# Altium schematic sheet NutX_Keyboard_PCB_ANSI104.SchDoc
size A0
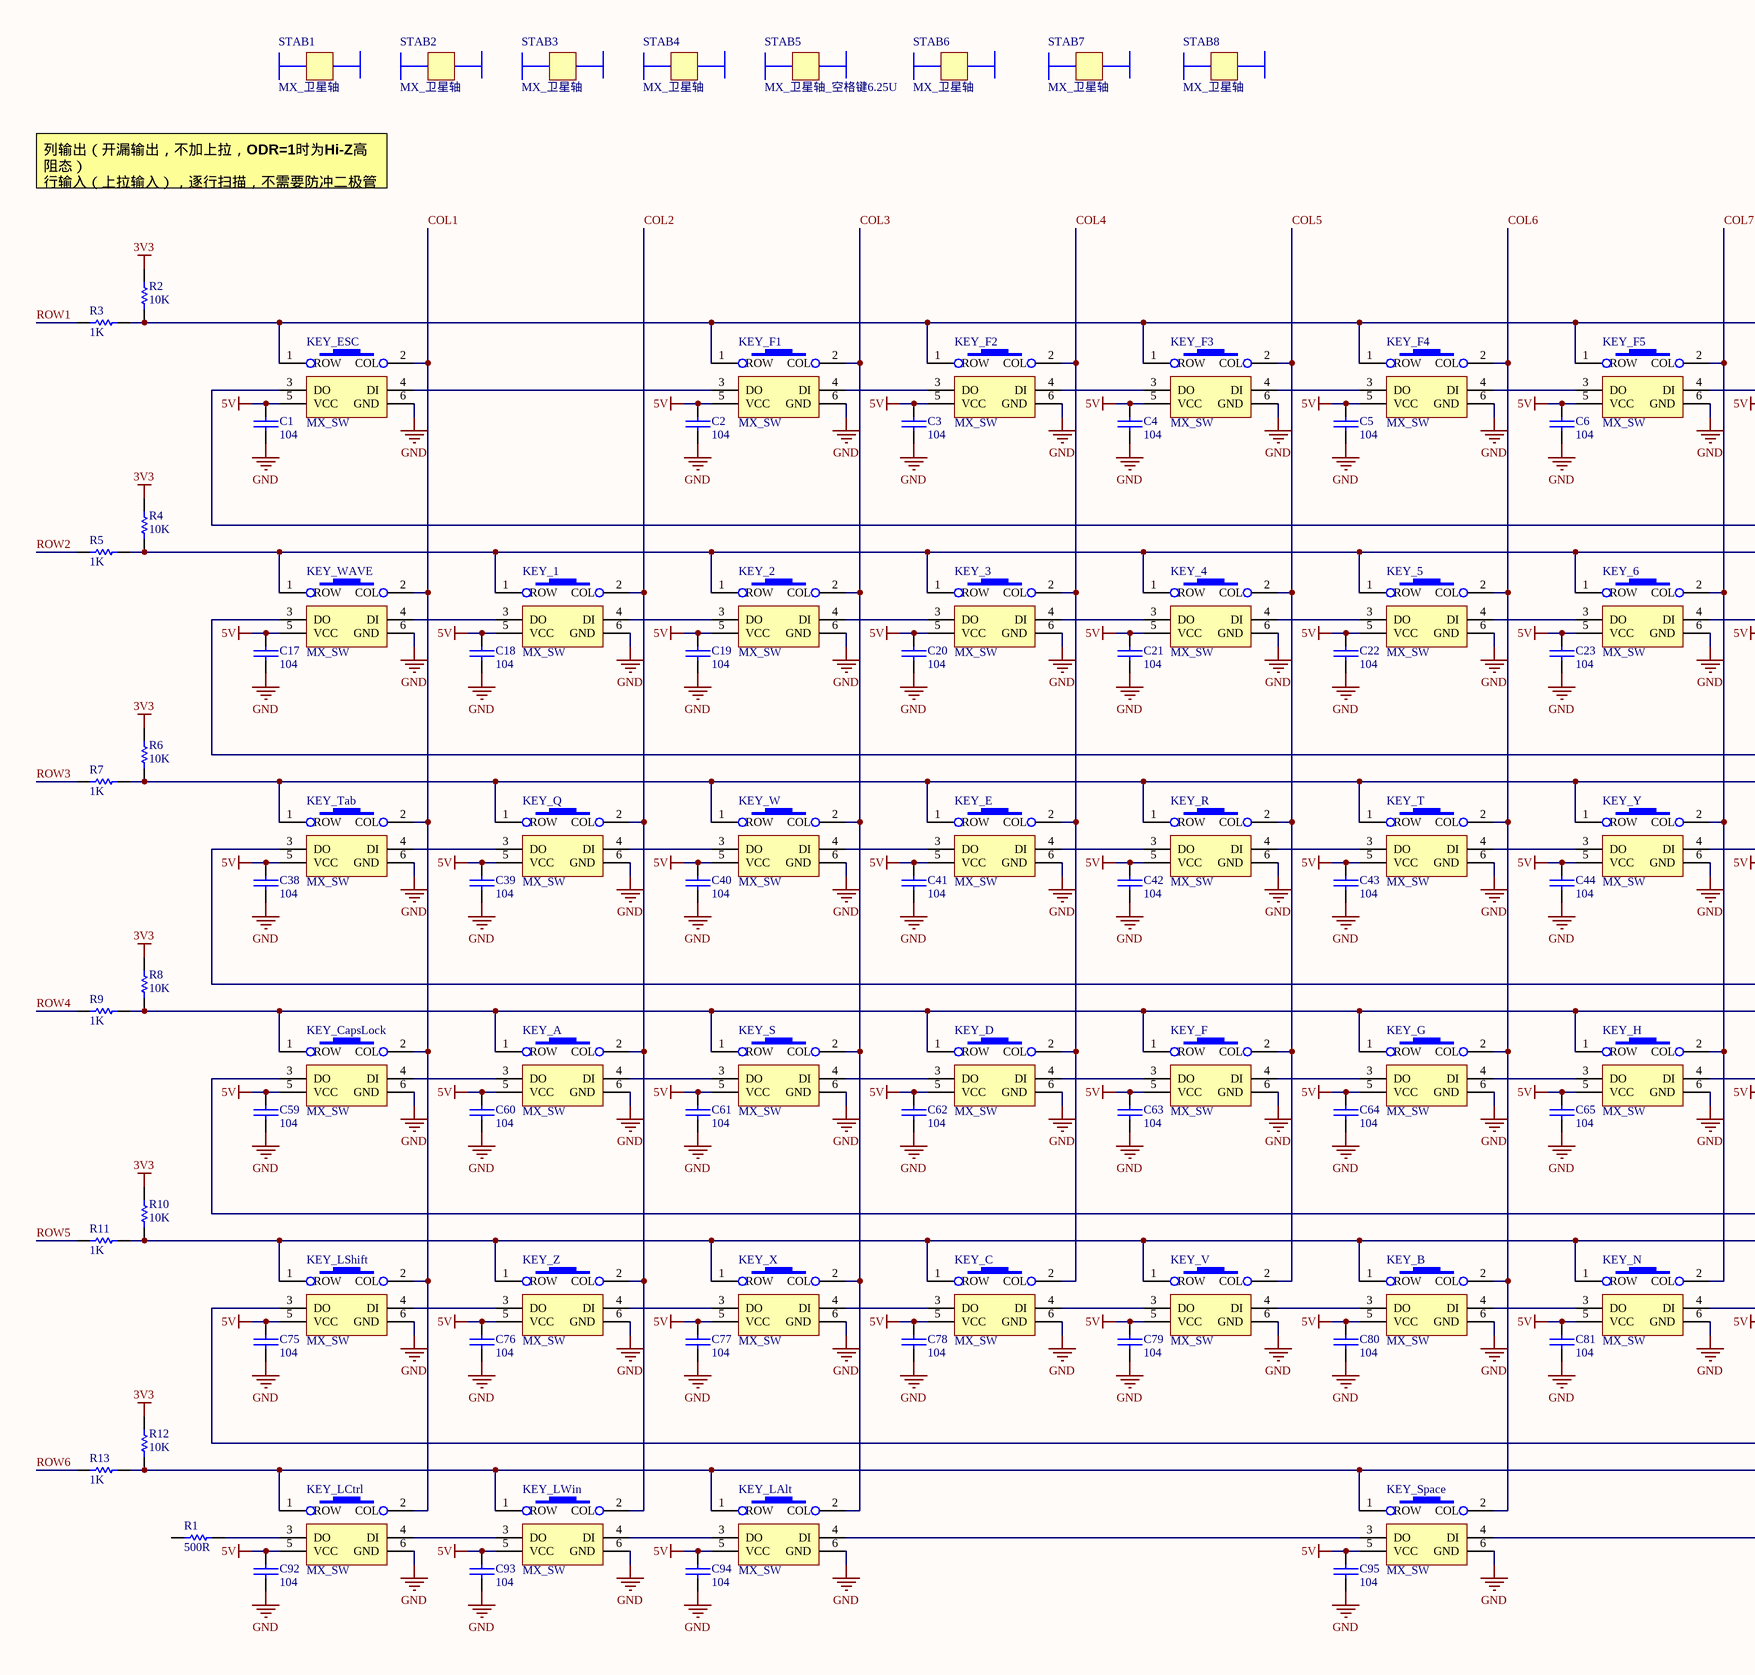
[diagram p0: NutX_Keyboard_PCB_ANSI104.SchDoc, left]
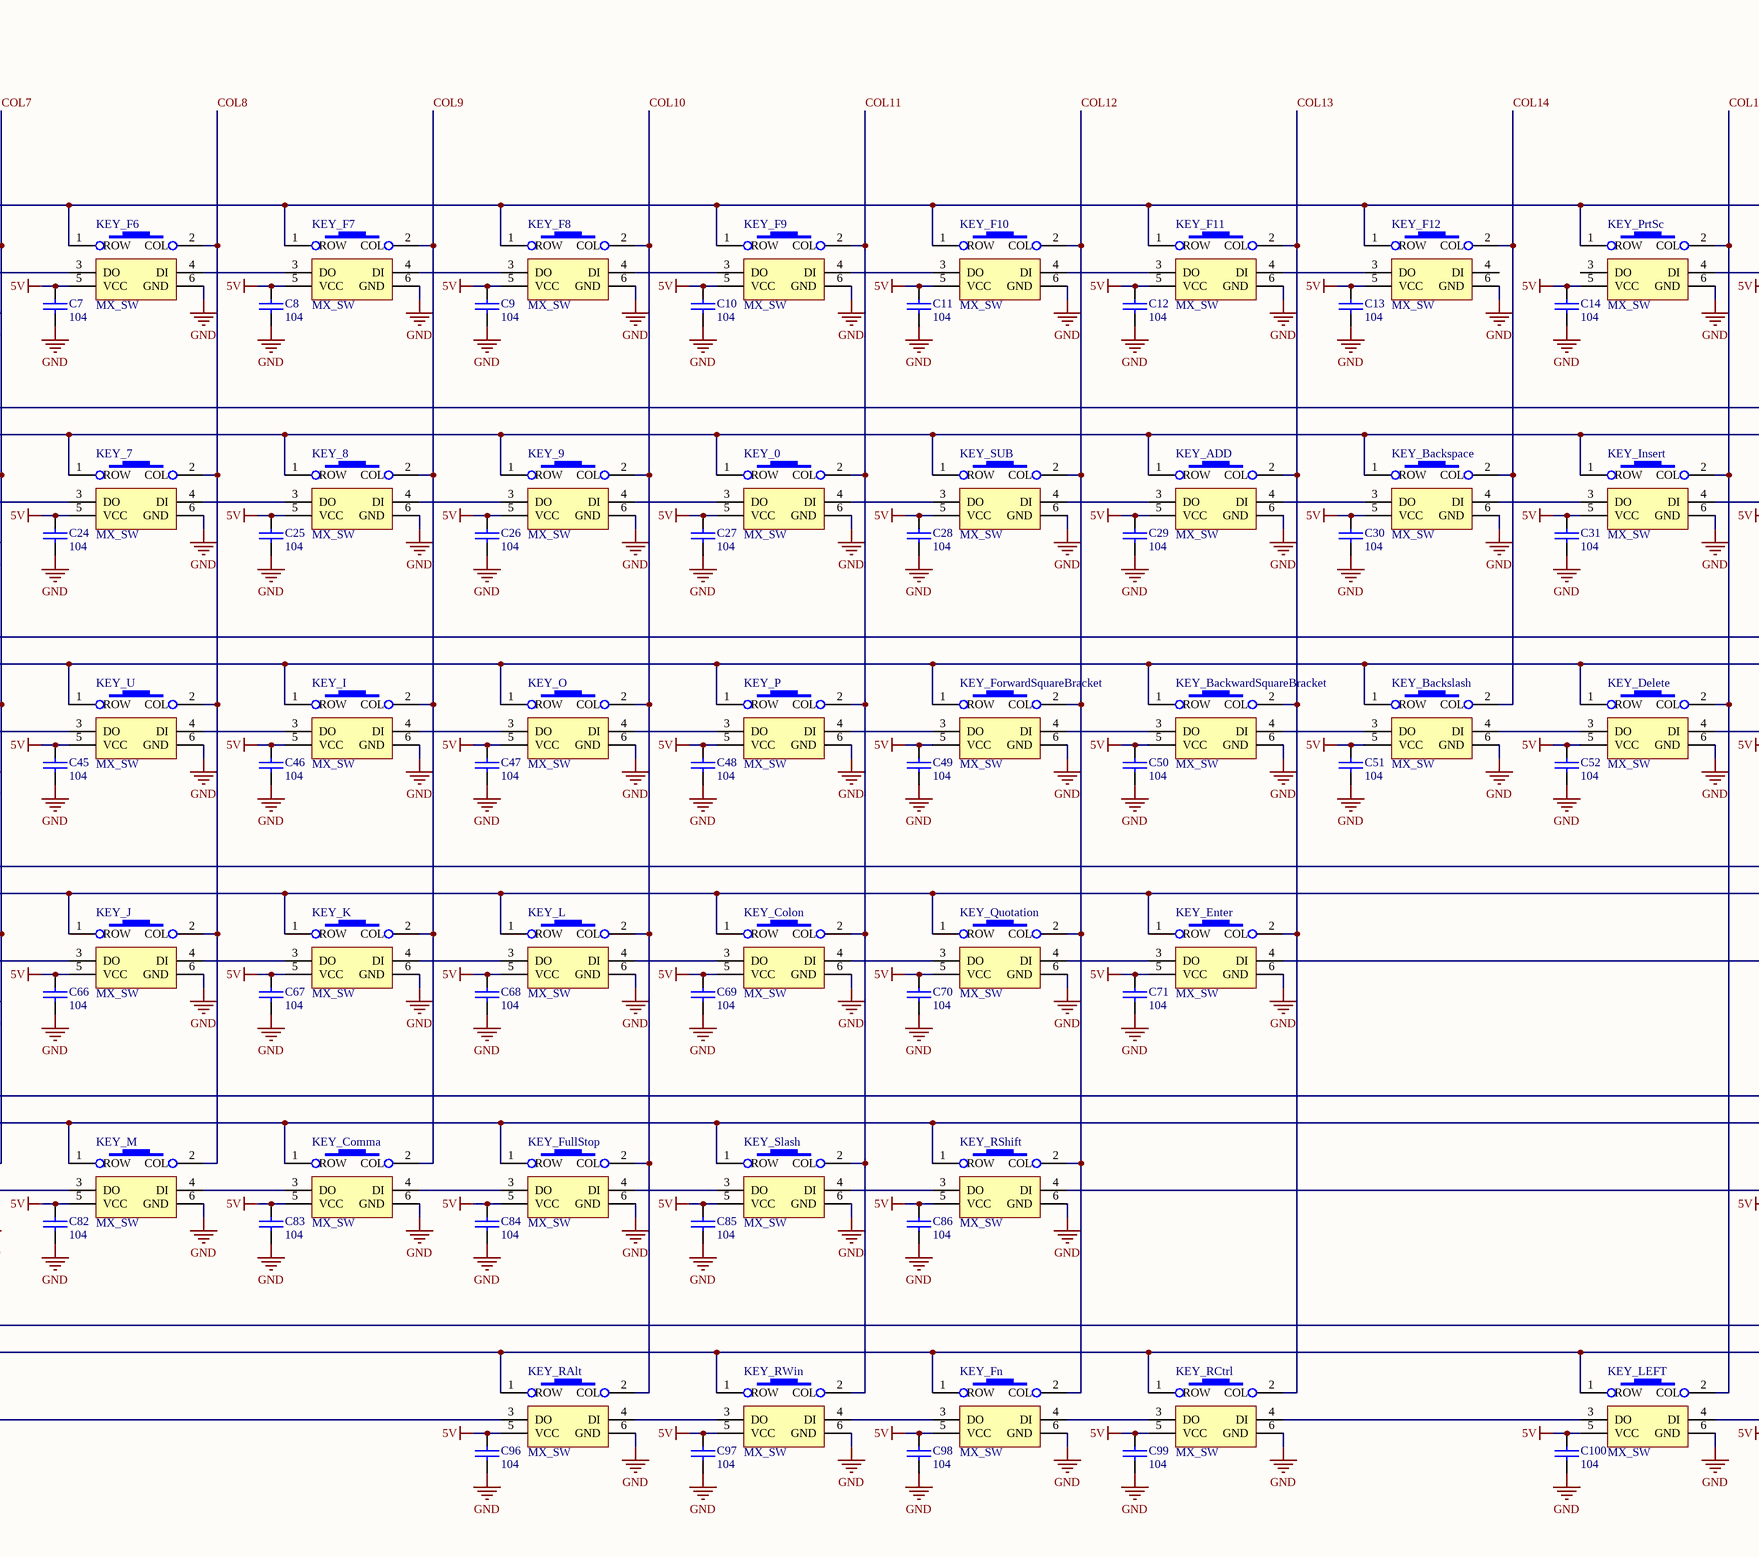
[diagram p1: NutX_Keyboard_PCB_ANSI104.SchDoc, middle]
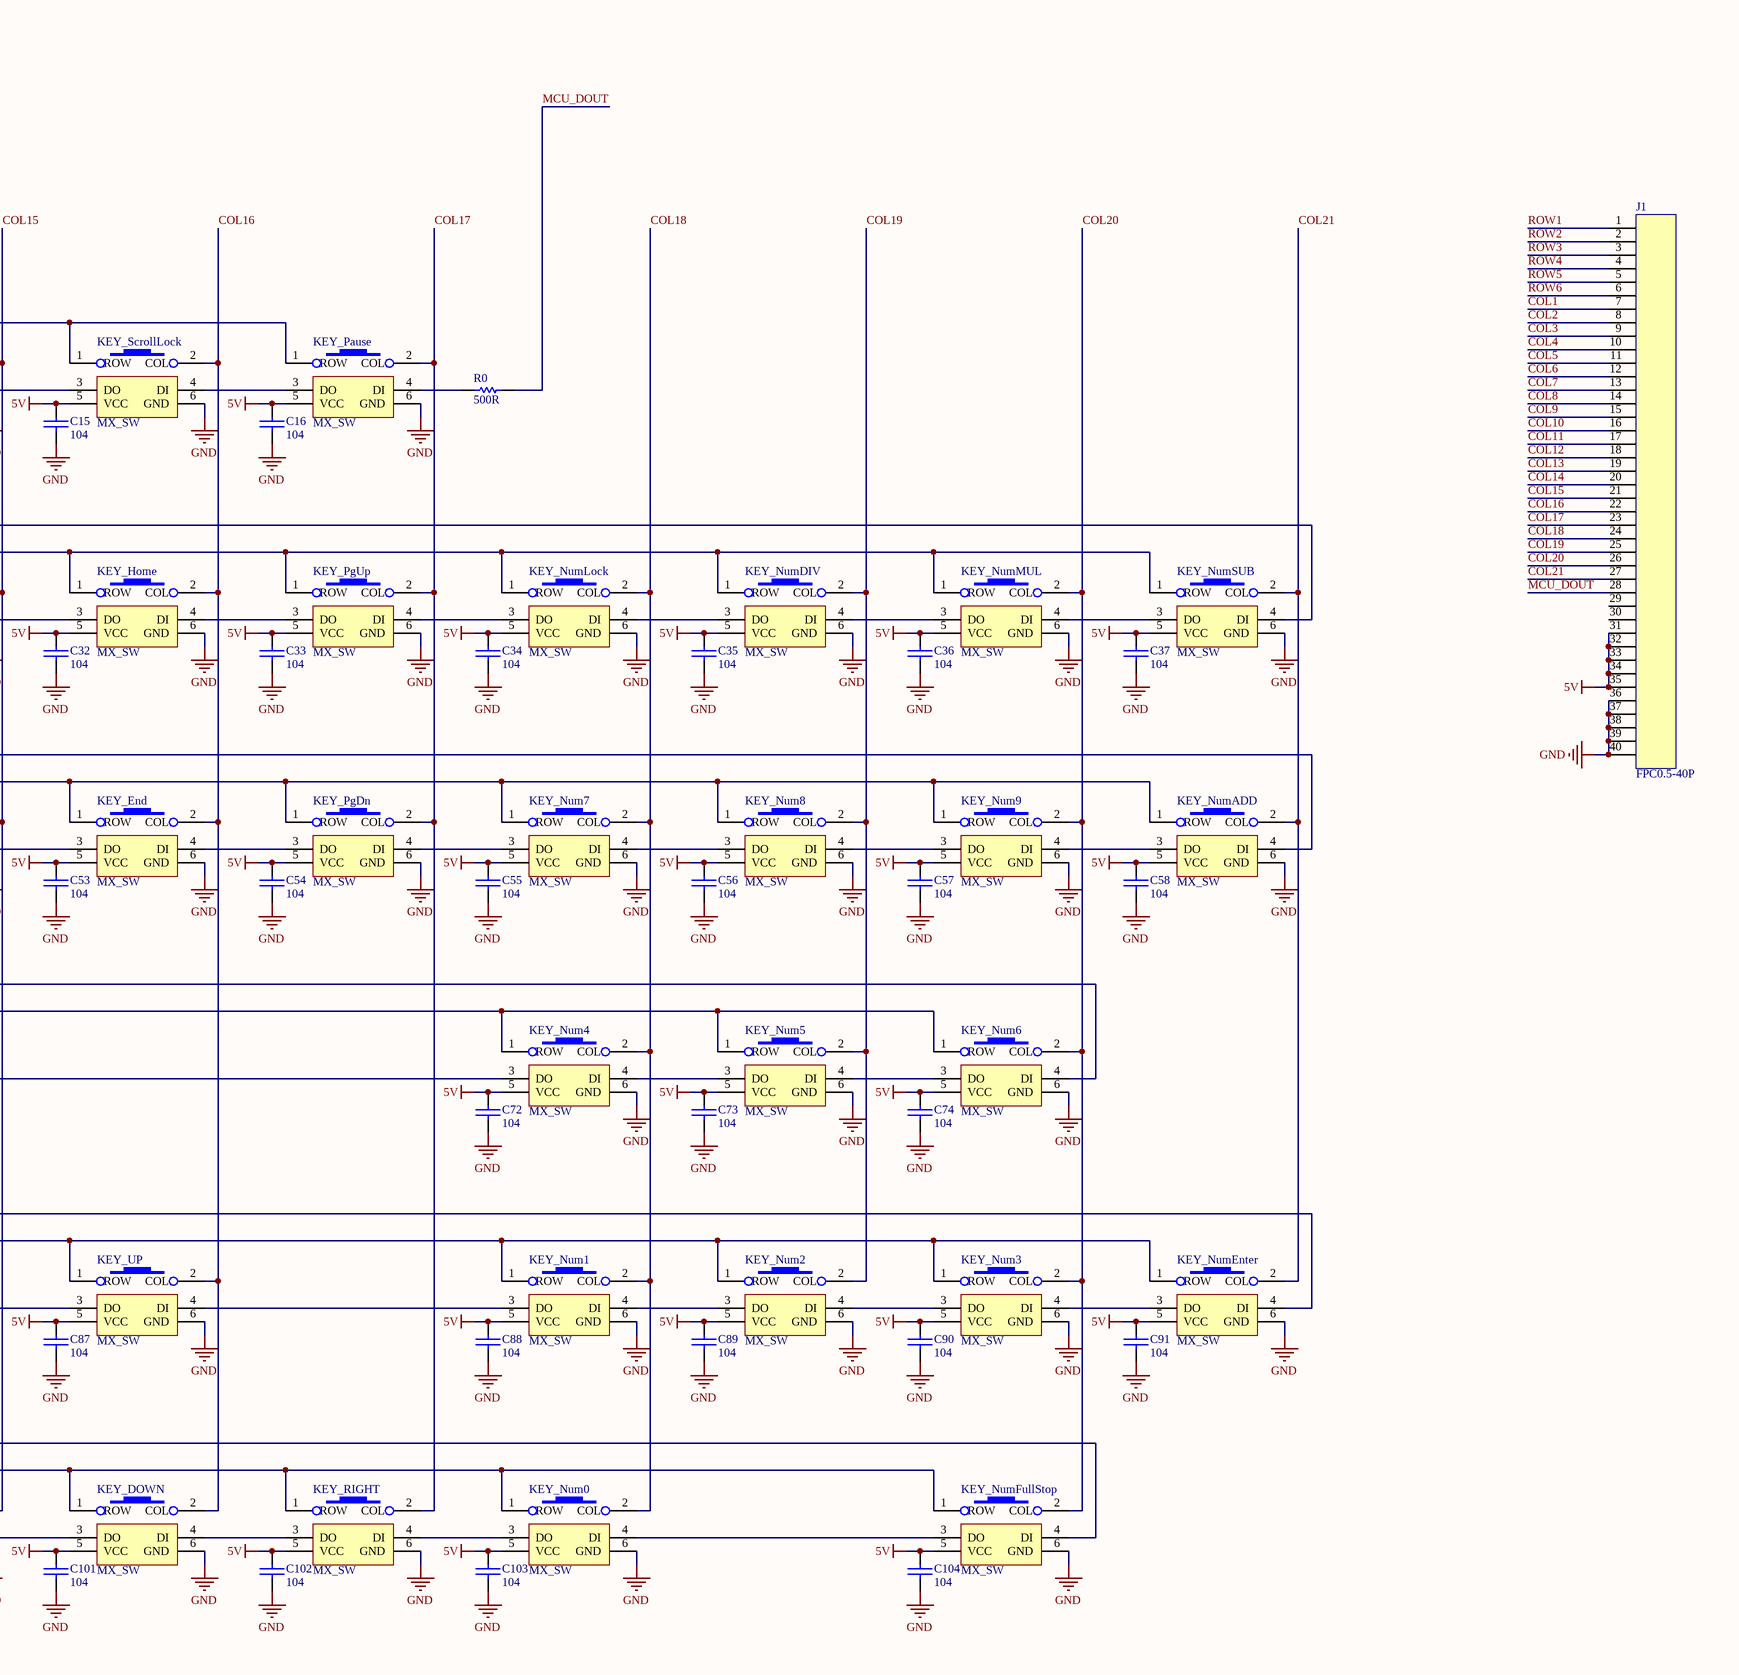
[diagram p2: NutX_Keyboard_PCB_ANSI104.SchDoc, right]

## Parts
C1  104  [0603C]
C2  104  [0603C]
C3  104  [0603C]
C4  104  [0603C]
C5  104  [0603C]
C6  104  [0603C]
C7  104  [0603C]
C8  104  [0603C]
C9  104  [0603C]
C10  104  [0603C]
C11  104  [0603C]
C12  104  [0603C]
C13  104  [0603C]
C14  104  [0603C]
C15  104  [0603C]
C16  104  [0603C]
C17  104  [0603C]
C18  104  [0603C]
C19  104  [0603C]
C20  104  [0603C]
C21  104  [0603C]
C22  104  [0603C]
C23  104  [0603C]
C24  104  [0603C]
C25  104  [0603C]
C26  104  [0603C]
C27  104  [0603C]
C28  104  [0603C]
C29  104  [0603C]
C30  104  [0603C]
C31  104  [0603C]
C32  104  [0603C]
C33  104  [0603C]
C34  104  [0603C]
C35  104  [0603C]
C36  104  [0603C]
C37  104  [0603C]
C38  104  [0603C]
C39  104  [0603C]
C40  104  [0603C]
C41  104  [0603C]
C42  104  [0603C]
C43  104  [0603C]
C44  104  [0603C]
C45  104  [0603C]
C46  104  [0603C]
C47  104  [0603C]
C48  104  [0603C]
C49  104  [0603C]
C50  104  [0603C]
C51  104  [0603C]
C52  104  [0603C]
C53  104  [0603C]
C54  104  [0603C]
C55  104  [0603C]
C56  104  [0603C]
C57  104  [0603C]
C58  104  [0603C]
C59  104  [0603C]
C60  104  [0603C]
C61  104  [0603C]
C62  104  [0603C]
C63  104  [0603C]
C64  104  [0603C]
C65  104  [0603C]
C66  104  [0603C]
C67  104  [0603C]
C68  104  [0603C]
C69  104  [0603C]
C70  104  [0603C]
C71  104  [0603C]
C72  104  [0603C]
C73  104  [0603C]
C74  104  [0603C]
C75  104  [0603C]
C76  104  [0603C]
C77  104  [0603C]
C78  104  [0603C]
C79  104  [0603C]
C80  104  [0603C]
C81  104  [0603C]
C82  104  [0603C]
C83  104  [0603C]
C84  104  [0603C]
C85  104  [0603C]
C86  104  [0603C]
C87  104  [0603C]
C88  104  [0603C]
C89  104  [0603C]
C90  104  [0603C]
C91  104  [0603C]
C92  104  [0603C]
C93  104  [0603C]
C94  104  [0603C]
C95  104  [0603C]
C96  104  [0603C]
C97  104  [0603C]
C98  104  [0603C]
C99  104  [0603C]
C100  104  [0603C]
C101  104  [0603C]
C102  104  [0603C]
C103  104  [0603C]
C104  104  [0603C]
J1  FPC0.5-40P  [FPC0.5-40P]
KEY_0  MX_SW  [MX_Normal_1U]
KEY_1  MX_SW  [MX_Normal_1U]
KEY_2  MX_SW  [MX_Normal_1U]
KEY_3  MX_SW  [MX_Normal_1U]
KEY_4  MX_SW  [MX_Normal_1U]
KEY_5  MX_SW  [MX_Normal_1U]
KEY_6  MX_SW  [MX_Normal_1U]
KEY_7  MX_SW  [MX_Normal_1U]
KEY_8  MX_SW  [MX_Normal_1U]
KEY_9  MX_SW  [MX_Normal_1U]
KEY_A  MX_SW  [MX_Normal_1U]
KEY_ADD  MX_SW  [MX_Normal_1U]
KEY_B  MX_SW  [MX_Normal_1U]
KEY_Backslash  MX_SW  [MX_Tab_1.5U]
KEY_Backspace  MX_SW  [MX_Backspace_2U]
KEY_BackwardSquareBracket  MX_SW  [MX_Normal_1U]
KEY_C  MX_SW  [MX_Normal_1U]
KEY_CapsLock  MX_SW  [MX_CapsLock_1.75U]
KEY_Colon  MX_SW  [MX_Normal_1U]
KEY_Comma  MX_SW  [MX_Normal_1U]
KEY_D  MX_SW  [MX_Normal_1U]
KEY_Delete  MX_SW  [MX_Normal_1U]
KEY_DOWN  MX_SW  [MX_Normal_1U]
KEY_E  MX_SW  [MX_Normal_1U]
KEY_End  MX_SW  [MX_Normal_1U]
KEY_Enter  MX_SW  [MX_LeftShift_Enter_2.25U]
KEY_ESC  MX_SW  [MX_Normal_1U]
KEY_F  MX_SW  [MX_Normal_1U]
KEY_F1  MX_SW  [MX_Normal_1U]
KEY_F2  MX_SW  [MX_Normal_1U]
KEY_F3  MX_SW  [MX_Normal_1U]
KEY_F4  MX_SW  [MX_Normal_1U]
KEY_F5  MX_SW  [MX_Normal_1U]
KEY_F6  MX_SW  [MX_Normal_1U]
KEY_F7  MX_SW  [MX_Normal_1U]
KEY_F8  MX_SW  [MX_Normal_1U]
KEY_F9  MX_SW  [MX_Normal_1U]
KEY_F10  MX_SW  [MX_Normal_1U]
KEY_F11  MX_SW  [MX_Normal_1U]
KEY_F12  MX_SW  [MX_Normal_1U]
KEY_Fn  MX_SW  [MX_Ctrl_Win_Alt_1.25U]
KEY_ForwardSquareBracket  MX_SW  [MX_Normal_1U]
KEY_FullStop  MX_SW  [MX_Normal_1U]
KEY_G  MX_SW  [MX_Normal_1U]
KEY_H  MX_SW  [MX_Normal_1U]
KEY_Home  MX_SW  [MX_Normal_1U]
KEY_I  MX_SW  [MX_Normal_1U]
KEY_Insert  MX_SW  [MX_Normal_1U]
KEY_J  MX_SW  [MX_Normal_1U]
KEY_K  MX_SW  [MX_Normal_1U]
KEY_L  MX_SW  [MX_Normal_1U]
KEY_LAlt  MX_SW  [MX_Ctrl_Win_Alt_1.25U]
KEY_LCtrl  MX_SW  [MX_Ctrl_Win_Alt_1.25U]
KEY_LEFT  MX_SW  [MX_Normal_1U]
KEY_LShift  MX_SW  [MX_LeftShift_Enter_2.25U]
KEY_LWin  MX_SW  [MX_Ctrl_Win_Alt_1.25U]
KEY_M  MX_SW  [MX_Normal_1U]
KEY_N  MX_SW  [MX_Normal_1U]
KEY_Num0  MX_SW  [MX_Backspace_2U]
KEY_Num1  MX_SW  [MX_Normal_1U]
KEY_Num2  MX_SW  [MX_Normal_1U]
KEY_Num3  MX_SW  [MX_Normal_1U]
KEY_Num4  MX_SW  [MX_Normal_1U]
KEY_Num5  MX_SW  [MX_Normal_1U]
KEY_Num6  MX_SW  [MX_Normal_1U]
KEY_Num7  MX_SW  [MX_Normal_1U]
KEY_Num8  MX_SW  [MX_Normal_1U]
KEY_Num9  MX_SW  [MX_Normal_1U]
KEY_NumADD  MX_SW  [MX_Backspace_2U]
KEY_NumDIV  MX_SW  [MX_Normal_1U]
KEY_NumEnter  MX_SW  [MX_Backspace_2U]
KEY_NumFullStop  MX_SW  [MX_Normal_1U]
KEY_NumLock  MX_SW  [MX_Normal_1U]
KEY_NumMUL  MX_SW  [MX_Normal_1U]
KEY_NumSUB  MX_SW  [MX_Normal_1U]
KEY_O  MX_SW  [MX_Normal_1U]
KEY_P  MX_SW  [MX_Normal_1U]
KEY_Pause  MX_SW  [MX_Normal_1U]
KEY_PgDn  MX_SW  [MX_Normal_1U]
KEY_PgUp  MX_SW  [MX_Normal_1U]
KEY_PrtSc  MX_SW  [MX_Normal_1U]
KEY_Q  MX_SW  [MX_Normal_1U]
KEY_Quotation  MX_SW  [MX_Normal_1U]
KEY_R  MX_SW  [MX_Normal_1U]
KEY_RAlt  MX_SW  [MX_Ctrl_Win_Alt_1.25U]
KEY_RCtrl  MX_SW  [MX_Ctrl_Win_Alt_1.25U]
KEY_RIGHT  MX_SW  [MX_Normal_1U]
KEY_RShift  MX_SW  [MX_RightShift_2.75U]
KEY_RWin  MX_SW  [MX_Ctrl_Win_Alt_1.25U]
KEY_S  MX_SW  [MX_Normal_1U]
KEY_ScrollLock  MX_SW  [MX_Normal_1U]
KEY_Slash  MX_SW  [MX_Normal_1U]
KEY_Space  MX_SW  [MX_Space_6.25U]
KEY_SUB  MX_SW  [MX_Normal_1U]
KEY_T  MX_SW  [MX_Normal_1U]
KEY_Tab  MX_SW  [MX_Tab_1.5U]
KEY_U  MX_SW  [MX_Normal_1U]
KEY_UP  MX_SW  [MX_Normal_1U]
KEY_V  MX_SW  [MX_Normal_1U]
KEY_W  MX_SW  [MX_Normal_1U]
KEY_WAVE  MX_SW  [MX_Normal_1U]
KEY_X  MX_SW  [MX_Normal_1U]
KEY_Y  MX_SW  [MX_Normal_1U]
KEY_Z  MX_SW  [MX_Normal_1U]
R0  500R  [0603R]
R1  500R  [0603R]
R2  10K  [0603R]
R3  1K  [0603R]
R4  10K  [0603R]
R5  1K  [0603R]
R6  10K  [0603R]
R7  1K  [0603R]
R8  10K  [0603R]
R9  1K  [0603R]
R10  10K  [0603R]
R11  1K  [0603R]
R12  10K  [0603R]
R13  1K  [0603R]
STAB1  MX_卫星轴  [1X2]
STAB2  MX_卫星轴  [1X2]
STAB3  MX_卫星轴  [1X2]
STAB4  MX_卫星轴  [1X2]
STAB5  MX_卫星轴_空格键6.25U  [1x6.25]
STAB6  MX_卫星轴  [1X2]
STAB7  MX_卫星轴  [1X2]
STAB8  MX_卫星轴  [1X2]

## Nets
3V3: R2.2 R4.2 R6.2 R8.2 R10.2 R12.2
5V: C1.2 C2.2 C3.2 C4.2 C5.2 C6.2 C7.2 C8.2 C9.2 C10.2 C11.2 C12.2 C13.2 C14.2 C15.2 C16.2 C17.2 C18.2 C19.2 C20.2 C21.2 C22.2 C23.2 C24.2 C25.2 C26.2 C27.2 C28.2 C29.2 C30.2 C31.2 C32.2 C33.2 C34.2 C35.2 C36.2 C37.2 C38.2 C39.2 C40.2 C41.2 C42.2 C43.2 C44.2 C45.2 C46.2 C47.2 C48.2 C49.2 C50.2 C51.2 C52.2 C53.2 C54.2 C55.2 C56.2 C57.2 C58.2 C59.2 C60.2 C61.2 C62.2 C63.2 C64.2 C65.2 C66.2 C67.2 C68.2 C69.2 C70.2 C71.2 C72.2 C73.2 C74.2 C75.2 C76.2 C77.2 C78.2 C79.2 C80.2 C81.2 C82.2 C83.2 C84.2 C85.2 C86.2 C87.2 C88.2 C89.2 C90.2 C91.2 C92.2 C93.2 C94.2 C95.2 C96.2 C97.2 C98.2 C99.2 C100.2 C101.2 C102.2 C103.2 C104.2 J1.31 J1.32 J1.33 J1.34 J1.35 KEY_0.5(VCC) KEY_1.5(VCC) KEY_2.5(VCC) KEY_3.5(VCC) KEY_4.5(VCC) KEY_5.5(VCC) KEY_6.5(VCC) KEY_7.5(VCC) KEY_8.5(VCC) KEY_9.5(VCC) KEY_A.5(VCC) KEY_ADD.5(VCC) KEY_B.5(VCC) KEY_Backslash.5(VCC) KEY_Backspace.5(VCC) KEY_BackwardSquareBracket.5(VCC) KEY_C.5(VCC) KEY_CapsLock.5(VCC) KEY_Colon.5(VCC) KEY_Comma.5(VCC) KEY_D.5(VCC) KEY_Delete.5(VCC) KEY_DOWN.5(VCC) KEY_E.5(VCC) KEY_End.5(VCC) KEY_Enter.5(VCC) KEY_ESC.5(VCC) KEY_F.5(VCC) KEY_F1.5(VCC) KEY_F2.5(VCC) KEY_F3.5(VCC) KEY_F4.5(VCC) KEY_F5.5(VCC) KEY_F6.5(VCC) KEY_F7.5(VCC) KEY_F8.5(VCC) KEY_F9.5(VCC) KEY_F10.5(VCC) KEY_F11.5(VCC) KEY_F12.5(VCC) KEY_Fn.5(VCC) KEY_ForwardSquareBracket.5(VCC) KEY_FullStop.5(VCC) KEY_G.5(VCC) KEY_H.5(VCC) KEY_Home.5(VCC) KEY_I.5(VCC) KEY_Insert.5(VCC) KEY_J.5(VCC) KEY_K.5(VCC) KEY_L.5(VCC) KEY_LAlt.5(VCC) KEY_LCtrl.5(VCC) KEY_LEFT.5(VCC) KEY_LShift.5(VCC) KEY_LWin.5(VCC) KEY_M.5(VCC) KEY_N.5(VCC) KEY_Num0.5(VCC) KEY_Num1.5(VCC) KEY_Num2.5(VCC) KEY_Num3.5(VCC) KEY_Num4.5(VCC) KEY_Num5.5(VCC) KEY_Num6.5(VCC) KEY_Num7.5(VCC) KEY_Num8.5(VCC) KEY_Num9.5(VCC) KEY_NumADD.5(VCC) KEY_NumDIV.5(VCC) KEY_NumEnter.5(VCC) KEY_NumFullStop.5(VCC) KEY_NumLock.5(VCC) KEY_NumMUL.5(VCC) KEY_NumSUB.5(VCC) KEY_O.5(VCC) KEY_P.5(VCC) KEY_Pause.5(VCC) KEY_PgDn.5(VCC) KEY_PgUp.5(VCC) KEY_PrtSc.5(VCC) KEY_Q.5(VCC) KEY_Quotation.5(VCC) KEY_R.5(VCC) KEY_RAlt.5(VCC) KEY_RCtrl.5(VCC) KEY_RIGHT.5(VCC) KEY_RShift.5(VCC) KEY_RWin.5(VCC) KEY_S.5(VCC) KEY_ScrollLock.5(VCC) KEY_Slash.5(VCC) KEY_Space.5(VCC) KEY_SUB.5(VCC) KEY_T.5(VCC) KEY_Tab.5(VCC) KEY_U.5(VCC) KEY_UP.5(VCC) KEY_V.5(VCC) KEY_W.5(VCC) KEY_WAVE.5(VCC) KEY_X.5(VCC) KEY_Y.5(VCC) KEY_Z.5(VCC)
GND: C1.1 C2.1 C3.1 C4.1 C5.1 C6.1 C7.1 C8.1 C9.1 C10.1 C11.1 C12.1 C13.1 C14.1 C15.1 C16.1 C17.1 C18.1 C19.1 C20.1 C21.1 C22.1 C23.1 C24.1 C25.1 C26.1 C27.1 C28.1 C29.1 C30.1 C31.1 C32.1 C33.1 C34.1 C35.1 C36.1 C37.1 C38.1 C39.1 C40.1 C41.1 C42.1 C43.1 C44.1 C45.1 C46.1 C47.1 C48.1 C49.1 C50.1 C51.1 C52.1 C53.1 C54.1 C55.1 C56.1 C57.1 C58.1 C59.1 C60.1 C61.1 C62.1 C63.1 C64.1 C65.1 C66.1 C67.1 C68.1 C69.1 C70.1 C71.1 C72.1 C73.1 C74.1 C75.1 C76.1 C77.1 C78.1 C79.1 C80.1 C81.1 C82.1 C83.1 C84.1 C85.1 C86.1 C87.1 C88.1 C89.1 C90.1 C91.1 C92.1 C93.1 C94.1 C95.1 C96.1 C97.1 C98.1 C99.1 C100.1 C101.1 C102.1 C103.1 C104.1 J1.36 J1.37 J1.38 J1.39 J1.40 KEY_0.6(GND) KEY_1.6(GND) KEY_2.6(GND) KEY_3.6(GND) KEY_4.6(GND) KEY_5.6(GND) KEY_6.6(GND) KEY_7.6(GND) KEY_8.6(GND) KEY_9.6(GND) KEY_A.6(GND) KEY_ADD.6(GND) KEY_B.6(GND) KEY_Backslash.6(GND) KEY_Backspace.6(GND) KEY_BackwardSquareBracket.6(GND) KEY_C.6(GND) KEY_CapsLock.6(GND) KEY_Colon.6(GND) KEY_Comma.6(GND) KEY_D.6(GND) KEY_Delete.6(GND) KEY_DOWN.6(GND) KEY_E.6(GND) KEY_End.6(GND) KEY_Enter.6(GND) KEY_ESC.6(GND) KEY_F.6(GND) KEY_F1.6(GND) KEY_F2.6(GND) KEY_F3.6(GND) KEY_F4.6(GND) KEY_F5.6(GND) KEY_F6.6(GND) KEY_F7.6(GND) KEY_F8.6(GND) KEY_F9.6(GND) KEY_F10.6(GND) KEY_F11.6(GND) KEY_F12.6(GND) KEY_Fn.6(GND) KEY_ForwardSquareBracket.6(GND) KEY_FullStop.6(GND) KEY_G.6(GND) KEY_H.6(GND) KEY_Home.6(GND) KEY_I.6(GND) KEY_Insert.6(GND) KEY_J.6(GND) KEY_K.6(GND) KEY_L.6(GND) KEY_LAlt.6(GND) KEY_LCtrl.6(GND) KEY_LEFT.6(GND) KEY_LShift.6(GND) KEY_LWin.6(GND) KEY_M.6(GND) KEY_N.6(GND) KEY_Num0.6(GND) KEY_Num1.6(GND) KEY_Num2.6(GND) KEY_Num3.6(GND) KEY_Num4.6(GND) KEY_Num5.6(GND) KEY_Num6.6(GND) KEY_Num7.6(GND) KEY_Num8.6(GND) KEY_Num9.6(GND) KEY_NumADD.6(GND) KEY_NumDIV.6(GND) KEY_NumEnter.6(GND) KEY_NumFullStop.6(GND) KEY_NumLock.6(GND) KEY_NumMUL.6(GND) KEY_NumSUB.6(GND) KEY_O.6(GND) KEY_P.6(GND) KEY_Pause.6(GND) KEY_PgDn.6(GND) KEY_PgUp.6(GND) KEY_PrtSc.6(GND) KEY_Q.6(GND) KEY_Quotation.6(GND) KEY_R.6(GND) KEY_RAlt.6(GND) KEY_RCtrl.6(GND) KEY_RIGHT.6(GND) KEY_RShift.6(GND) KEY_RWin.6(GND) KEY_S.6(GND) KEY_ScrollLock.6(GND) KEY_Slash.6(GND) KEY_Space.6(GND) KEY_SUB.6(GND) KEY_T.6(GND) KEY_Tab.6(GND) KEY_U.6(GND) KEY_UP.6(GND) KEY_V.6(GND) KEY_W.6(GND) KEY_WAVE.6(GND) KEY_X.6(GND) KEY_Y.6(GND) KEY_Z.6(GND)
COL1: J1.7 KEY_CapsLock.2(COL) KEY_ESC.2(COL) KEY_LCtrl.2(COL) KEY_LShift.2(COL) KEY_Tab.2(COL) KEY_WAVE.2(COL)
COL2: J1.8 KEY_1.2(COL) KEY_A.2(COL) KEY_LWin.2(COL) KEY_Q.2(COL) KEY_Z.2(COL)
COL3: J1.9 KEY_2.2(COL) KEY_F1.2(COL) KEY_LAlt.2(COL) KEY_S.2(COL) KEY_W.2(COL) KEY_X.2(COL)
COL4: J1.10 KEY_3.2(COL) KEY_C.2(COL) KEY_D.2(COL) KEY_E.2(COL) KEY_F2.2(COL)
COL5: J1.11 KEY_4.2(COL) KEY_F.2(COL) KEY_F3.2(COL) KEY_R.2(COL) KEY_V.2(COL)
COL6: J1.12 KEY_5.2(COL) KEY_B.2(COL) KEY_F4.2(COL) KEY_G.2(COL) KEY_Space.2(COL) KEY_T.2(COL)
COL7: J1.13 KEY_6.2(COL) KEY_F5.2(COL) KEY_H.2(COL) KEY_N.2(COL) KEY_Y.2(COL)
COL8: J1.14 KEY_7.2(COL) KEY_F6.2(COL) KEY_J.2(COL) KEY_M.2(COL) KEY_U.2(COL)
COL9: J1.15 KEY_8.2(COL) KEY_Comma.2(COL) KEY_F7.2(COL) KEY_I.2(COL) KEY_K.2(COL)
COL10: J1.16 KEY_9.2(COL) KEY_F8.2(COL) KEY_FullStop.2(COL) KEY_L.2(COL) KEY_O.2(COL) KEY_RAlt.2(COL)
COL11: J1.17 KEY_0.2(COL) KEY_Colon.2(COL) KEY_F9.2(COL) KEY_P.2(COL) KEY_RWin.2(COL) KEY_Slash.2(COL)
COL12: J1.18 KEY_F10.2(COL) KEY_Fn.2(COL) KEY_ForwardSquareBracket.2(COL) KEY_Quotation.2(COL) KEY_RShift.2(COL) KEY_SUB.2(COL)
COL13: J1.19 KEY_ADD.2(COL) KEY_BackwardSquareBracket.2(COL) KEY_Enter.2(COL) KEY_F11.2(COL) KEY_RCtrl.2(COL)
COL14: J1.20 KEY_Backslash.2(COL) KEY_Backspace.2(COL) KEY_F12.2(COL)
COL15: J1.21 KEY_Delete.2(COL) KEY_Insert.2(COL) KEY_LEFT.2(COL) KEY_PrtSc.2(COL)
COL16: J1.22 KEY_DOWN.2(COL) KEY_End.2(COL) KEY_Home.2(COL) KEY_ScrollLock.2(COL) KEY_UP.2(COL)
COL17: J1.23 KEY_Pause.2(COL) KEY_PgDn.2(COL) KEY_PgUp.2(COL) KEY_RIGHT.2(COL)
COL18: J1.24 KEY_Num0.2(COL) KEY_Num1.2(COL) KEY_Num4.2(COL) KEY_Num7.2(COL) KEY_NumLock.2(COL)
COL19: J1.25 KEY_Num2.2(COL) KEY_Num5.2(COL) KEY_Num8.2(COL) KEY_NumDIV.2(COL)
COL20: J1.26 KEY_Num3.2(COL) KEY_Num6.2(COL) KEY_Num9.2(COL) KEY_NumFullStop.2(COL) KEY_NumMUL.2(COL)
COL21: J1.27 KEY_NumADD.2(COL) KEY_NumEnter.2(COL) KEY_NumSUB.2(COL)
MCU_DOUT: J1.28 R0.2
ROW1: J1.1 R3.1
ROW2: J1.2 R5.1
ROW3: J1.3 R7.1
ROW4: J1.4 R9.1
ROW5: J1.5 R11.1
ROW6: J1.6 R13.1
NetKEY_0_1: KEY_0.1(ROW) KEY_1.1(ROW) KEY_2.1(ROW) KEY_3.1(ROW) KEY_4.1(ROW) KEY_5.1(ROW) KEY_6.1(ROW) KEY_7.1(ROW) KEY_8.1(ROW) KEY_9.1(ROW) KEY_ADD.1(ROW) KEY_Backspace.1(ROW) KEY_Home.1(ROW) KEY_Insert.1(ROW) KEY_NumDIV.1(ROW) KEY_NumLock.1(ROW) KEY_NumMUL.1(ROW) KEY_NumSUB.1(ROW) KEY_PgUp.1(ROW) KEY_SUB.1(ROW) KEY_WAVE.1(ROW) R4.1 R5.2
NetKEY_0_3: KEY_0.3(DO) KEY_9.4(DI)
NetKEY_0_4: KEY_0.4(DI) KEY_SUB.3(DO)
NetKEY_1_3: KEY_1.3(DO) KEY_WAVE.4(DI)
NetKEY_1_4: KEY_1.4(DI) KEY_2.3(DO)
NetKEY_2_4: KEY_2.4(DI) KEY_3.3(DO)
NetKEY_3_4: KEY_3.4(DI) KEY_4.3(DO)
NetKEY_4_4: KEY_4.4(DI) KEY_5.3(DO)
NetKEY_5_4: KEY_5.4(DI) KEY_6.3(DO)
NetKEY_6_4: KEY_6.4(DI) KEY_7.3(DO)
NetKEY_7_4: KEY_7.4(DI) KEY_8.3(DO)
NetKEY_8_4: KEY_8.4(DI) KEY_9.3(DO)
NetKEY_A_1: KEY_A.1(ROW) KEY_CapsLock.1(ROW) KEY_Colon.1(ROW) KEY_D.1(ROW) KEY_Enter.1(ROW) KEY_F.1(ROW) KEY_G.1(ROW) KEY_H.1(ROW) KEY_J.1(ROW) KEY_K.1(ROW) KEY_L.1(ROW) KEY_Num4.1(ROW) KEY_Num5.1(ROW) KEY_Num6.1(ROW) KEY_Quotation.1(ROW) KEY_S.1(ROW) R8.1 R9.2
NetKEY_A_3: KEY_A.3(DO) KEY_CapsLock.4(DI)
NetKEY_A_4: KEY_A.4(DI) KEY_S.3(DO)
NetKEY_ADD_3: KEY_ADD.3(DO) KEY_SUB.4(DI)
NetKEY_ADD_4: KEY_ADD.4(DI) KEY_Backspace.3(DO)
NetKEY_B_1: KEY_B.1(ROW) KEY_C.1(ROW) KEY_Comma.1(ROW) KEY_FullStop.1(ROW) KEY_LShift.1(ROW) KEY_M.1(ROW) KEY_N.1(ROW) KEY_Num1.1(ROW) KEY_Num2.1(ROW) KEY_Num3.1(ROW) KEY_NumEnter.1(ROW) KEY_RShift.1(ROW) KEY_Slash.1(ROW) KEY_UP.1(ROW) KEY_V.1(ROW) KEY_X.1(ROW) KEY_Z.1(ROW) R10.1 R11.2
NetKEY_B_3: KEY_B.3(DO) KEY_V.4(DI)
NetKEY_B_4: KEY_B.4(DI) KEY_N.3(DO)
NetKEY_Backslash_1: KEY_Backslash.1(ROW) KEY_BackwardSquareBracket.1(ROW) KEY_Delete.1(ROW) KEY_E.1(ROW) KEY_End.1(ROW) KEY_ForwardSquareBracket.1(ROW) KEY_I.1(ROW) KEY_Num7.1(ROW) KEY_Num8.1(ROW) KEY_Num9.1(ROW) KEY_NumADD.1(ROW) KEY_O.1(ROW) KEY_P.1(ROW) KEY_PgDn.1(ROW) KEY_Q.1(ROW) KEY_R.1(ROW) KEY_T.1(ROW) KEY_Tab.1(ROW) KEY_U.1(ROW) KEY_W.1(ROW) KEY_Y.1(ROW) R6.1 R7.2
NetKEY_Backslash_3: KEY_Backslash.3(DO) KEY_BackwardSquareBracket.4(DI)
NetKEY_Backslash_4: KEY_Backslash.4(DI) KEY_Delete.3(DO)
NetKEY_Backspace_4: KEY_Backspace.4(DI) KEY_Insert.3(DO)
NetKEY_BackwardSquareBracket_3: KEY_BackwardSquareBracket.3(DO) KEY_ForwardSquareBracket.4(DI)
NetKEY_C_3: KEY_C.3(DO) KEY_X.4(DI)
NetKEY_C_4: KEY_C.4(DI) KEY_V.3(DO)
NetKEY_CapsLock_3: KEY_CapsLock.3(DO) KEY_NumEnter.4(DI)
NetKEY_Colon_3: KEY_Colon.3(DO) KEY_L.4(DI)
NetKEY_Colon_4: KEY_Colon.4(DI) KEY_Quotation.3(DO)
NetKEY_Comma_3: KEY_Comma.3(DO) KEY_M.4(DI)
NetKEY_Comma_4: KEY_Comma.4(DI) KEY_FullStop.3(DO)
NetKEY_D_3: KEY_D.3(DO) KEY_S.4(DI)
NetKEY_D_4: KEY_D.4(DI) KEY_F.3(DO)
NetKEY_Delete_4: KEY_Delete.4(DI) KEY_End.3(DO)
NetKEY_DOWN_1: KEY_DOWN.1(ROW) KEY_Fn.1(ROW) KEY_LAlt.1(ROW) KEY_LCtrl.1(ROW) KEY_LEFT.1(ROW) KEY_LWin.1(ROW) KEY_Num0.1(ROW) KEY_NumFullStop.1(ROW) KEY_RAlt.1(ROW) KEY_RCtrl.1(ROW) KEY_RIGHT.1(ROW) KEY_RWin.1(ROW) KEY_Space.1(ROW) R12.1 R13.2
NetKEY_DOWN_3: KEY_DOWN.3(DO) KEY_LEFT.4(DI)
NetKEY_DOWN_4: KEY_DOWN.4(DI) KEY_RIGHT.3(DO)
NetKEY_E_3: KEY_E.3(DO) KEY_W.4(DI)
NetKEY_E_4: KEY_E.4(DI) KEY_R.3(DO)
NetKEY_End_4: KEY_End.4(DI) KEY_PgDn.3(DO)
NetKEY_Enter_3: KEY_Enter.3(DO) KEY_Quotation.4(DI)
NetKEY_Enter_4: KEY_Enter.4(DI) KEY_Num4.3(DO)
NetKEY_ESC_1: KEY_ESC.1(ROW) KEY_F1.1(ROW) KEY_F2.1(ROW) KEY_F3.1(ROW) KEY_F4.1(ROW) KEY_F5.1(ROW) KEY_F6.1(ROW) KEY_F7.1(ROW) KEY_F8.1(ROW) KEY_F9.1(ROW) KEY_F10.1(ROW) KEY_F11.1(ROW) KEY_F12.1(ROW) KEY_Pause.1(ROW) KEY_PrtSc.1(ROW) KEY_ScrollLock.1(ROW) R2.1 R3.2
NetKEY_ESC_3: KEY_ESC.3(DO) KEY_NumSUB.4(DI)
NetKEY_ESC_4: KEY_ESC.4(DI) KEY_F1.3(DO)
NetKEY_F1_4: KEY_F1.4(DI) KEY_F2.3(DO)
NetKEY_F2_4: KEY_F2.4(DI) KEY_F3.3(DO)
NetKEY_F3_4: KEY_F3.4(DI) KEY_F4.3(DO)
NetKEY_F4_4: KEY_F4.4(DI) KEY_F5.3(DO)
NetKEY_F5_4: KEY_F5.4(DI) KEY_F6.3(DO)
NetKEY_F6_4: KEY_F6.4(DI) KEY_F7.3(DO)
NetKEY_F7_4: KEY_F7.4(DI) KEY_F8.3(DO)
NetKEY_F8_4: KEY_F8.4(DI) KEY_F9.3(DO)
NetKEY_F9_4: KEY_F9.4(DI) KEY_F10.3(DO)
NetKEY_F10_4: KEY_F10.4(DI) KEY_F11.3(DO)
NetKEY_F11_4: KEY_F11.4(DI) KEY_F12.3(DO)
NetKEY_F_4: KEY_F.4(DI) KEY_G.3(DO)
NetKEY_Fn_3: KEY_Fn.3(DO) KEY_RWin.4(DI)
NetKEY_Fn_4: KEY_Fn.4(DI) KEY_RCtrl.3(DO)
NetKEY_ForwardSquareBracket_3: KEY_ForwardSquareBracket.3(DO) KEY_P.4(DI)
NetKEY_FullStop_4: KEY_FullStop.4(DI) KEY_Slash.3(DO)
NetKEY_G_4: KEY_G.4(DI) KEY_H.3(DO)
NetKEY_H_4: KEY_H.4(DI) KEY_J.3(DO)
NetKEY_Home_3: KEY_Home.3(DO) KEY_Insert.4(DI)
NetKEY_Home_4: KEY_Home.4(DI) KEY_PgUp.3(DO)
NetKEY_I_3: KEY_I.3(DO) KEY_U.4(DI)
NetKEY_I_4: KEY_I.4(DI) KEY_O.3(DO)
NetKEY_J_4: KEY_J.4(DI) KEY_K.3(DO)
NetKEY_K_4: KEY_K.4(DI) KEY_L.3(DO)
NetKEY_LAlt_3: KEY_LAlt.3(DO) KEY_LWin.4(DI)
NetKEY_LAlt_4: KEY_LAlt.4(DI) KEY_Space.3(DO)
NetKEY_LCtrl_3: KEY_LCtrl.3(DO) R1.2
NetKEY_LCtrl_4: KEY_LCtrl.4(DI) KEY_LWin.3(DO)
NetKEY_LEFT_3: KEY_LEFT.3(DO) KEY_RCtrl.4(DI)
NetKEY_LShift_3: KEY_LShift.3(DO) KEY_NumFullStop.4(DI)
NetKEY_LShift_4: KEY_LShift.4(DI) KEY_Z.3(DO)
NetKEY_M_3: KEY_M.3(DO) KEY_N.4(DI)
NetKEY_Num0_3: KEY_Num0.3(DO) KEY_RIGHT.4(DI)
NetKEY_Num0_4: KEY_Num0.4(DI) KEY_NumFullStop.3(DO)
NetKEY_Num1_3: KEY_Num1.3(DO) KEY_UP.4(DI)
NetKEY_Num1_4: KEY_Num1.4(DI) KEY_Num2.3(DO)
NetKEY_Num2_4: KEY_Num2.4(DI) KEY_Num3.3(DO)
NetKEY_Num3_4: KEY_Num3.4(DI) KEY_NumEnter.3(DO)
NetKEY_Num4_4: KEY_Num4.4(DI) KEY_Num5.3(DO)
NetKEY_Num5_4: KEY_Num5.4(DI) KEY_Num6.3(DO)
NetKEY_Num6_4: KEY_Num6.4(DI) KEY_Tab.3(DO)
NetKEY_Num7_3: KEY_Num7.3(DO) KEY_PgDn.4(DI)
NetKEY_Num7_4: KEY_Num7.4(DI) KEY_Num8.3(DO)
NetKEY_Num8_4: KEY_Num8.4(DI) KEY_Num9.3(DO)
NetKEY_Num9_4: KEY_Num9.4(DI) KEY_NumADD.3(DO)
NetKEY_NumADD_4: KEY_NumADD.4(DI) KEY_WAVE.3(DO)
NetKEY_NumDIV_3: KEY_NumDIV.3(DO) KEY_NumLock.4(DI)
NetKEY_NumDIV_4: KEY_NumDIV.4(DI) KEY_NumMUL.3(DO)
NetKEY_NumLock_3: KEY_NumLock.3(DO) KEY_PgUp.4(DI)
NetKEY_NumMUL_4: KEY_NumMUL.4(DI) KEY_NumSUB.3(DO)
NetKEY_O_4: KEY_O.4(DI) KEY_P.3(DO)
NetKEY_Pause_3: KEY_Pause.3(DO) KEY_ScrollLock.4(DI)
NetKEY_Pause_4: KEY_Pause.4(DI) R0.1
NetKEY_PrtSc_4: KEY_PrtSc.4(DI) KEY_ScrollLock.3(DO)
NetKEY_Q_3: KEY_Q.3(DO) KEY_Tab.4(DI)
NetKEY_Q_4: KEY_Q.4(DI) KEY_W.3(DO)
NetKEY_R_4: KEY_R.4(DI) KEY_T.3(DO)
NetKEY_RAlt_3: KEY_RAlt.3(DO) KEY_Space.4(DI)
NetKEY_RAlt_4: KEY_RAlt.4(DI) KEY_RWin.3(DO)
NetKEY_RShift_3: KEY_RShift.3(DO) KEY_Slash.4(DI)
NetKEY_RShift_4: KEY_RShift.4(DI) KEY_UP.3(DO)
NetKEY_T_4: KEY_T.4(DI) KEY_Y.3(DO)
NetKEY_U_3: KEY_U.3(DO) KEY_Y.4(DI)
NetKEY_X_3: KEY_X.3(DO) KEY_Z.4(DI)

Not connected (* = marked no-connect by the designer): J1 29 30; KEY_F12 4(DI); KEY_PrtSc 3(DO); R1 1

## Notes on the sheet
- 列输出（开漏输出，不加上拉，ODR=1时为Hi-Z高阻态）
  行输入（上拉输入），逐行扫描，不需要防冲二极管

## Library data of the parts
C1-C104 = CAP: 无极性电容
J1 = FPC0.5-40P: 贴片
R0-R13 = RES
STAB1-STAB8 = MX_卫星轴: Cherry MX Stabilizer 樱桃卫星轴